# Altium schematic sheet CHANGELOG.SchDoc
size A4; SheetNumber: 7; SheetTotal: 7
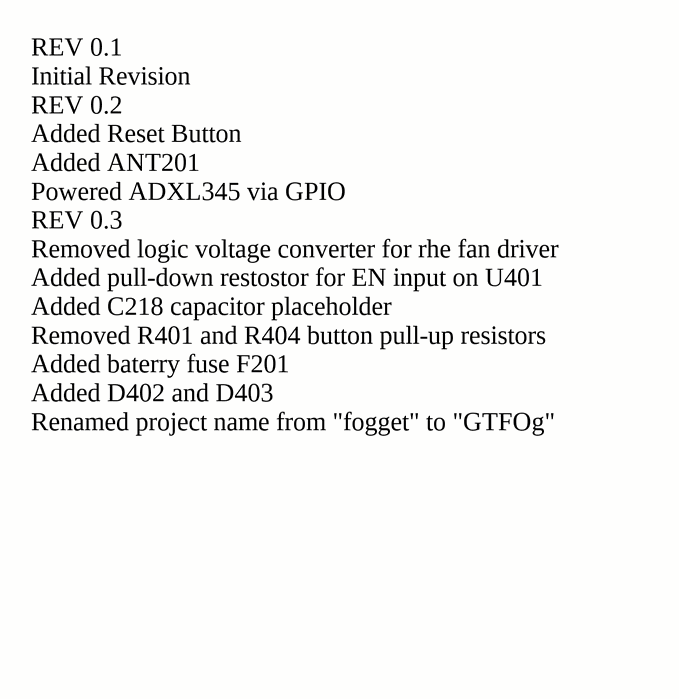
[diagram p0: CHANGELOG.SchDoc]

## Notes on the sheet
- REV 0.1
  Initial Revision
  REV 0.2
  Added Reset Button
  Added ANT201
  Powered ADXL345 via GPIO
  REV 0.3
  Removed logic voltage converter for rhe fan driver
  Added pull-down restostor for EN input on U401
  Added C218 capacitor placeholder
  Removed R401 and R404 button pull-up resistors
  Added baterry fuse F201
  Added D402 and D403
  Renamed project name from "fogget" to "GTFOg"
- Title:
- Sheet:
- of
- Author:
- Model:
- Document Number:
- Checked by:
- Iss-Rev:
- Approved by:
- Date:
- File name: